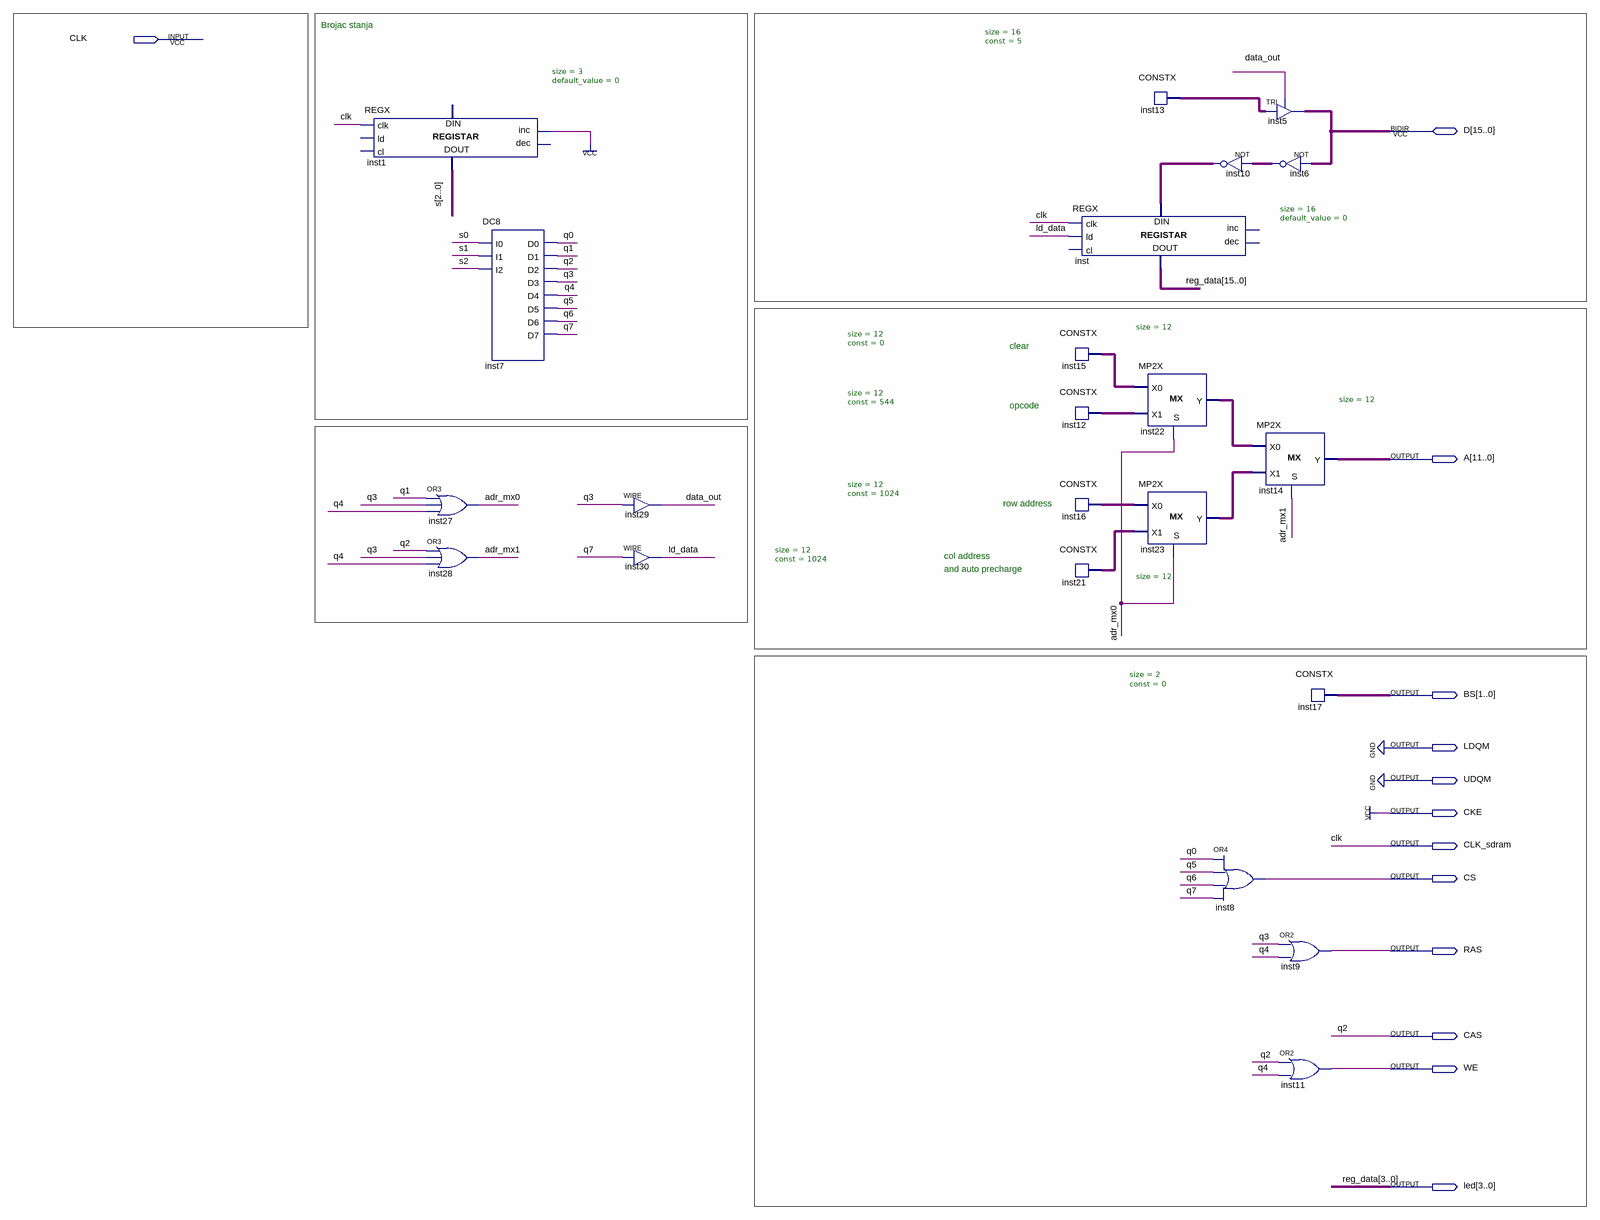
[diagram p0: schematic sheet]
// Quartus schematic sdram_controller_test.bdf as structural Verilog: 22 symbols, 13 pins
module sdram_controller_test (
  input  CLK,
  inout  [15:0] D,
  output [11:0] A,
  output [1:0] BS,
  output LDQM,
  output UDQM,
  output CKE,
  output CLK_sdram,
  output CS,
  output RAS,
  output CAS,
  output WE,
  output [3:0] led
);

  wire adr_mx0, adr_mx1, data_out, ld_data, q0, q1, q3, q4, q5, q6, q7;
  wire [2:0] s;
  wire [11:0] inst12_data, inst15_data, inst16_data, inst21_data, inst22_y, inst23_y;
  wire [15:0] inst6_out, inst10_out, inst13_data;
  wire [15:4] reg_data;

  REGX #(.size(3), .default_value(0)) inst1 (.clk(CLK), .inc(1'b1), .data_out(s));  // open: ld, cl, dec, data_in
  or inst27 (adr_mx0, q1, q3, q4);
  or inst28 (adr_mx1, CAS, q3, q4);
  DC8 inst7 (.I0(s[0]), .I1(s[1]), .I2(s[2]), .D0(q0), .D1(q1), .D2(CAS), .D3(q3), .D4(q4), .D5(q5), .D6(q6), .D7(q7));
  assign data_out = q3;  // WIRE inst29
  assign ld_data = q7;  // WIRE inst30
  CONSTX #(.size(12), .\const (0)) inst15 (.data(inst15_data));
  CONSTX #(.size(12), .\const (544)) inst12 (.data(inst12_data));
  CONSTX #(.size(12), .\const (1024)) inst16 (.data(inst16_data));
  CONSTX #(.size(12), .\const (1024)) inst21 (.data(inst21_data));
  REGX #(.size(16), .default_value(0)) inst (
    .clk(CLK), .ld(ld_data), .data_in(inst10_out), .data_out({reg_data, led}));  // open: cl, inc, dec
  CONSTX #(.size(16), .\const (5)) inst13 (.data(inst13_data));
  MP2X #(.size(12)) inst22 (.S(adr_mx0), .X0(inst15_data), .X1(inst12_data), .Y(inst22_y));
  MP2X #(.size(12)) inst23 (.S(adr_mx0), .X0(inst16_data), .X1(inst21_data), .Y(inst23_y));
  assign inst10_out = ~inst6_out;  // NOT inst10, 16 bits wide
  or inst8 (CS, q0, q5, q6, q7);
  TRI inst5[15:0] (.IN(inst13_data), .OE(data_out), .OUT(D));
  MP2X #(.size(12)) inst14 (.S(adr_mx1), .X0(inst22_y), .X1(inst23_y), .Y(A));
  assign inst6_out = ~D;  // NOT inst6, 16 bits wide
  CONSTX #(.size(2), .\const (0)) inst17 (.data(BS));
  or inst9 (RAS, q3, q4);
  or inst11 (WE, CAS, q4);

  assign CKE = 1'b1;
  assign CLK_sdram = CLK;
  assign LDQM = 1'b0;
  assign UDQM = 1'b0;

  // Other names for the same wires on the sheet: q2 = CAS; reg_data[3:0] = led

  // Notes on the sheet:
  //   Brojac stanja
  //   clear
  //   opcode
  //   row address
  //   col address
  //   and auto precharge
endmodule
